# Altium schematic sheet Proximidad.SchDoc
size A4
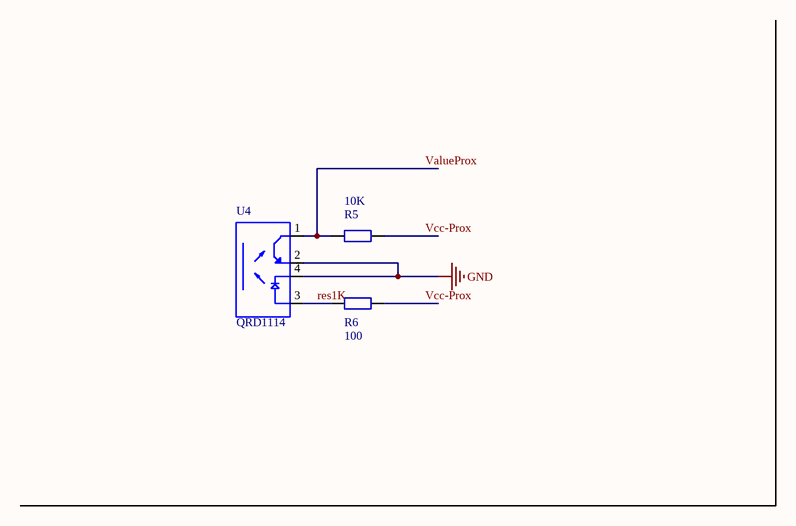
[diagram p0: Proximidad.SchDoc]

## Parts
R5  value 10K  [R1206-0.55]  (hidden comment: R)
R6  value 100  [R1206-0.55]  (hidden comment: R)
U4  QRD1114  [*ONS_QRD1114]

## Nets
GND: U4.2(ET) U4.4(C)
res1K: R6.1 U4.3(A)
ValueProx: R5.1 U4.1(CT)
Vcc-Prox: R5.2 R6.2

## Library data of the parts
R5 R6 = R: Resistor, generic
U4 = QRD1114: Sensor Ã³ptico reflectante 0.050 _1.27 mm_ radial - 4 conductores; MF: ON Semiconductor; Digi-Key_Part_Number: QRD1114-ND; Package: Radial-4 ON Semiconductor; SnapEDA_Link: https://www.snapeda.com/parts/QRD1114/ON%20Semiconductor/view-part/2706462/?ref=snap; Digi-Key_Purchase_URL: https://www.digikey.com/product-detail/en/on-semiconductor/QRD1114/QRD1114-ND/187536?utm_source=snapeda&utm_medium=aggregator&utm_campaign=symbol; MP: QRD1114; Value: *